# Altium schematic sheet IEPE.SchDoc
size A4; CompanyName: TH Nürnberg; Organization: UltraZohm; Address1: Kesslerplatz 12; Address2: 90489 Nürnberg; Address3: GERMANY; SheetNumber: 3; SheetTotal: 10
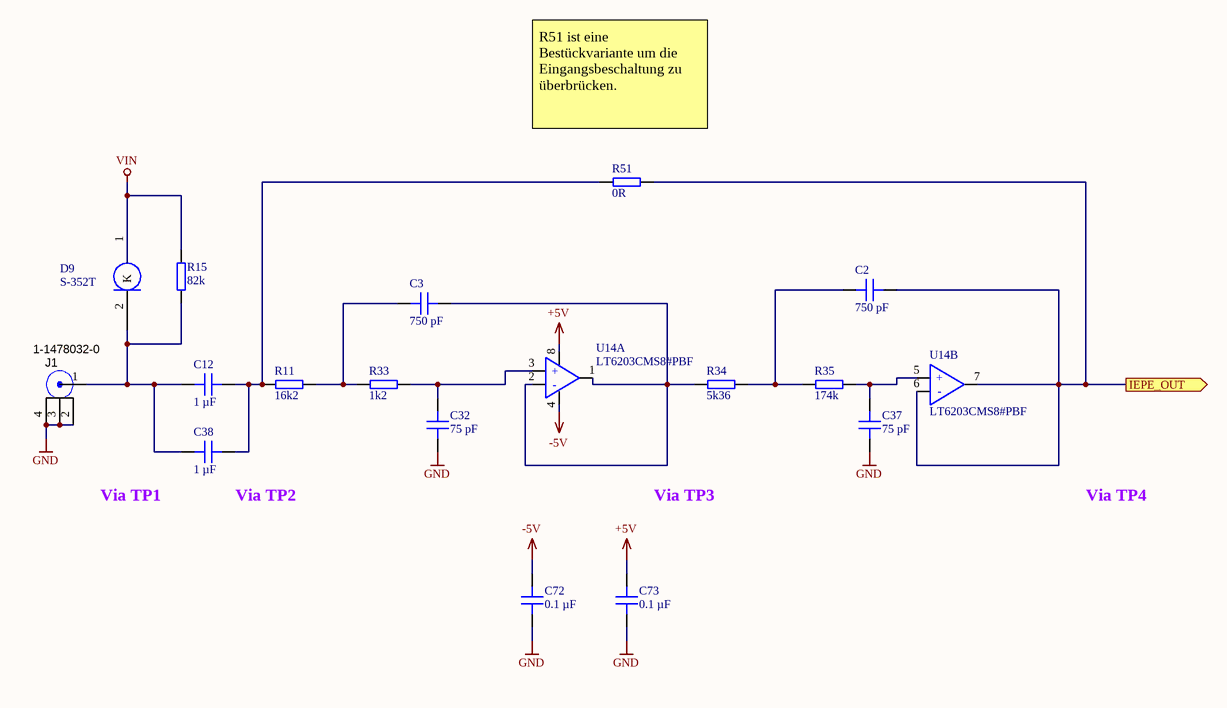
[diagram p0: IEPE.SchDoc]

## Parts
C2  750 pF  [C_0603]
C3  750 pF  [C_0603]
C12  1 µF  [C_0603]
C32  75 pF  [C_0603]
C37  75 pF  [C_0603]
C38  1 µF  [C_0603]
C72  0.1 µF  [C_0603]
C73  0.1 µF  [C_0603]
D9  S-352T  [CRD]
J1  1-1478032-0  [Right Angle BNC]
R11  16k2  [RES 0603_1608]
R15  82k  [RES 0603_1608]
R33  1k2  [RES 0603_1608]
R34  5k36  [RES 0603_1608]
R35  174k  [RES 0603_1608]
R51  0R  [RES 0603_1608]
U14  LT6203CMS8#PBF  [MSOP8_3x3-8N]  (parts A,B of 2)

## Ports
IEPE_OUT (out)

## Nets
+5V: C73.2 U14.8
-5V: C72.2 U14.4
GND: C32.1 C37.1 C72.1 C73.1 J1.2 J1.3 J1.4
VIN: D9.1(A) R15.2
IEPE_OUT: C2.2 R51.2 U14.6(-) U14.7 ; port IEPE_OUT
NetC2_1: C2.1 R34.2 R35.1
NetC3_1: C3.1 R11.2 R33.1
NetC3_2: C3.2 R34.1 U14.1 U14.2(-)
NetC12_1: C12.1 C38.1 D9.2(K) J1.1 R15.1
NetC12_2: C12.2 C38.2 R11.1 R51.1
NetC32_2: C32.2 R33.2 U14.3(+)
NetC37_2: C37.2 R35.2 U14.5(+)

## Notes on the sheet
- R51 ist eine Bestückvariante um die Eingangsbeschaltung zu überbrücken.
- (near C38) Via TP1
- (near C38) Via TP2
- Via TP3
- Via TP4
- Title
- Revision:
- Design Engineer:
- Date:
- Project:
- Sheet
- of

## Library data of the parts
C2 C3 = C0603C751J5GACAUTO: Capacitor 0603, 50 VDC, 750 pF, C0G; Manufacturer: KEMET; Tolerance: 5 %; Voltage Rating: 50 VDC; Created from: MGremer; Manufacturer Part Number: C0603C751J5GACAUTO; PartID: 82; Created On: 20.12.2020 13:54:13; ComponentLink1Description: Datasheet; ComponentLink1URL: https://www.mouser.de/datasheet/2/212/KEM_C1022_C0G_AUTO_SMD-1093282.pdf; Component Type: Capacitor 0603; Device Package: 0603; Last Updated: 20.01.2021 13:57:36; Mounting Type: SMD; Operating Temperature: -55 - 125°C; Series: C0G; Supplier 1: Mouser; Supplier Part Number 1: 80-C0603C751J5GAUTO; Type: Capacitor; Value: 750 pF; Live Cycle Status: 1; Stock number: not stored
C12 C38 = UMK107AB7105KA-T: Capacitor 0603, 50 VDC, 1 µF, X7R; Manufacturer: Taiyo Yuden; Tolerance: 10 %; Voltage Rating: 50 VDC; Created from: MGremer; Manufacturer Part Number: UMK107AB7105KA-T; PartID: 5; Created On: 20.12.2020 13:54:13; ComponentLink1Description: Datasheet; ComponentLink1URL: https://www.mouser.de/datasheet/2/396/mlcc02_e-1307760.pdf; Component Type: Capacitor 0603; Device Package: 0603; Last Updated: 20.12.2020 16:42:28; Mounting Type: SMD; Operating Temperature: -55 - 125°C; Series: M; Supplier 1: Mouser; Supplier Part Number 1: 963-UMK107AB7105KA-T; Type: Capacitor; Value: 1 µF; Live Cycle Status: 1; Stock number: Labor SMD Container
C32 C37 = C0603C750J5RACAUTO: Capacitor 0603, 50 VDC, 75 pF, X7R; Manufacturer: KEMET; Tolerance: 5 %; Voltage Rating: 50 VDC; Created from: MGremer; Manufacturer Part Number: C0603C750J5RACAUTO; PartID: 83; Created On: 20.12.2020 13:54:13; ComponentLink1Description: Datasheet; ComponentLink1URL: https://www.mouser.de/datasheet/2/212/KEM_C1023_X7R_AUTO_SMD-1093309.pdf; Component Type: Capacitor 0603; Device Package: 0603; Last Updated: 20.01.2021 13:57:36; Mounting Type: SMD; Operating Temperature: -55 - 125°C; Series: C0G; Supplier 1: Mouser; Supplier Part Number 1: 80-C0603C750J5RAUTO; Type: Capacitor; Value: 75 pF; Live Cycle Status: 1; Stock number: not stored
C72 C73 = C0603X104K5RAC7411: Capacitor 0603, 50 VDC, 0.1 µF, X7R; Manufacturer: KEMET; Tolerance: 10 %; Voltage Rating: 50 VDC; Created from: MGremer; Manufacturer Part Number: C0603X104K5RAC7411; PartID: 3; Created On: 20.12.2020 13:54:13; ComponentLink1Description: Datasheet; ComponentLink1URL: https://www.mouser.de/datasheet/2/212/1/KEM_C1013_X7R_FT_CAP_SMD-1103280.pdf; Component Type: Capacitor 0603; Device Package: 0603; Last Updated: 04.03.2021 09:24:28; Mounting Type: SMD; Operating Temperature: -55 - 125°C; Series: SMD Comm X7R Flex; Supplier 1: Mouser; Supplier Part Number 1: 80-C0603X104K5R7411; Supplier 2: LCSC; Supplier Part Number 2: C14663; Type: Capacitor; Value: 0.1 µF; Live Cycle Status: 1; LCSC Part Number: C14663; Stock number: Labor SMD Container
D9 = S-352T: Current Regulator Diodes 100V 3.5mA; Manufacturer: Semitec; Type: CRD Diode; Created from: PTurowski; Manufacturer Part Number: S-352T; PartID: 1; Created On: 25.05.2021 10:37:04; ComponentLink1Description: Datasheet; ComponentLink1URL: https://www.mouser.de/datasheet/2/362/P22-23-CRD-1729293.pdf; Component Type: CRD Diode; Last Updated: 25.05.2021 10:37:04; Mounting Type: SMD/SMT; Operating Temperature: -40 to 150 °C; Supplier 1: Mouser; Supplier Part Number 1: 954-S-352T; Live Cycle Status: 1; Stock number: 0
J1 = 1-1478032-0: BNC Connector; Manufacturer: TE; PartNumber: Used in BOM report; SymbolVersion: use current date i.e. 2008-05-20; SymbolCreator: Use LDAP id; CompType: Used in some BOM reports.  Useful for finding later.; U/M: EA, IN, or GM; Created from: FSchoenig, MGremer; MountType: SMT, TH, or N/A; RoHS: Used in BOM report.  Use Y or N.; PackageReference: eg:  0603, used in PnP report; ComponentLink1Description: Datasheet; ComponentLink1URL: https://www.te.com/commerce/DocumentDelivery/DDEController?Action=showdoc&DocId=Data+Sheet%7F6-1773448-5_ZDC_RF_COAX_50-75_OHM%7F1007%7Fpdf%7FEnglish%7FENG_DS_6-1773448-5_ZDC_RF_COAX_50-75_OHM_1007.pdf&src-supplier=Avnet; Alternate PartNumber: -; Alternate Manufacturer: -; Supplier 1: Digi-Key; Supplier Part Number 1: A97560-ND; Manufacturer Part Number: 1-1478032-0; PartID: 3; Created On: 12.05.2021 17:41:04; Component Type: BNC; Device Package: BNC; Last Updated: 24.08.2021 10:46:04; Mounting Type: THT; Type: BNC; Live Cycle Status: 1; Stock number: not stored
R11 = AC0603FR-0716K2L: SMD resistor 1%; Manufacturer: YAGEO; Created from: MGremer; Manufacturer Part Number: AC0603FR-0716K2L; PartID: 194; Created On: 14.12.2020 16:17:14; ComponentLink1Description: Datasheet; ComponentLink1URL: https://www.mouser.de/datasheet/2/447/PYu_AC_51_RoHS_L_7-1714230.pdf; Component Type: SMD resistor; Device Package: 0603; Last Updated: 02.07.2021 11:49:34; Mounting Type: SMD; Supplier 1: Mouser; Supplier Part Number 1: 603-AC0603FR-0716K2L; Type: Resistor; Tolerance: 1%; Value: 16k2; Live Cycle Status: 1; Stock number: not stored
R15 = RK73B1JTTDD823J: SMD resistor E24 series; Manufacturer: KOA Speer; Tolerance: 5%; Created from: MGremer; Manufacturer Part Number: RK73B1JTTDD823J; PartID: 120; Created On: 14.12.2020 16:17:14; ComponentLink1Description: Datasheet; ComponentLink1URL: https://www.mouser.de/datasheet/2/219/RK73B-1825463.pdf; Component Type: SMD resistor; Device Package: 0603; Last Updated: 02.03.2021 14:07:32; Mounting Type: SMD; Supplier 1: Mouser; Supplier Part Number 1: 660-RK73B1JTTDD823J; Type: Resistor; Value: 82k; Live Cycle Status: 1; Stock number: Labor SMD Container
R33 = RK73B1JTTD122J: SMD resistor E24 series; Manufacturer: KOA Speer; Tolerance: 5%; Created from: MGremer; Manufacturer Part Number: RK73B1JTTD122J; PartID: 76; Created On: 14.12.2020 16:17:14; ComponentLink1Description: Datasheet; ComponentLink1URL: https://www.mouser.de/datasheet/2/219/RK73B-1825463.pdf; Component Type: SMD resistor; Device Package: 0603; Last Updated: 02.03.2021 14:07:32; Mounting Type: SMD; Supplier 1: Mouser; Supplier Part Number 1: 660-RK73B1JTTD122J; Type: Resistor; Value: 1k2; Live Cycle Status: 1; Stock number: Labor SMD Container
R34 = AC0603FR-075K36L: SMD resistor 1%; Manufacturer: YAGEO; Created from: MGremer; Manufacturer Part Number: AC0603FR-075K36L; PartID: 195; Created On: 14.12.2020 16:17:14; ComponentLink1Description: Datasheet; ComponentLink1URL: https://www.mouser.de/datasheet/2/447/PYu_AC_51_RoHS_L_7-1714230.pdf; Component Type: SMD resistor; Device Package: 0603; Last Updated: 02.07.2021 11:49:34; Mounting Type: SMD; Supplier 1: Mouser; Supplier Part Number 1: 603-AC0603FR-075K36L; Type: Resistor; Tolerance: 1%; Value: 5k36; Live Cycle Status: 1; Stock number: not stored
R35 = RC0603FR-07174KL: SMD resistor 1%; Manufacturer: YAGEO; Created from: MGremer; Manufacturer Part Number: RC0603FR-07174KL; PartID: 196; Created On: 14.12.2020 16:17:14; ComponentLink1Description: Datasheet; ComponentLink1URL: https://www.mouser.de/datasheet/2/447/Yageo_03_18_2021_PYu_RC_Group_51_RoHS_L_11-2199992.pdf; Component Type: SMD resistor; Device Package: 0603; Last Updated: 02.07.2021 11:49:34; Mounting Type: SMD; Supplier 1: Mouser; Supplier Part Number 1: 603-RC0603FR-07174KL; Type: Resistor; Tolerance: 1%; Value: 174k; Live Cycle Status: 1; Stock number: not stored
R51 = RC0603JR-070RL: SMD resistor E24 series; Manufacturer: YAGEO; Tolerance: 5%; Created from: MGremer; Manufacturer Part Number: RC0603JR-070RL; PartID: 1; Created On: 14.12.2020 16:17:14; ComponentLink1Description: Datasheet; ComponentLink1URL: https://www.mouser.de/datasheet/2/447/PYu-RC_Group_51_RoHS_L_10-1664068.pdf; Component Type: SMD resistor; Device Package: 0603; Last Updated: 04.03.2021 09:09:42; Mounting Type: SMD; Supplier 1: Mouser; Supplier Part Number 1: 603-RC0603JR-070RL; Supplier 2: LCSC; Supplier Part Number 2: C21189; Type: Resistor; Value: 0R; Live Cycle Status: 1; Stock number: Labor SMD Container; LCSC Part Number: C21189
U14 = LT6203CMS8#PBF: Operational Amplifier, Rail-to-Rail, ultralow noise; Manufacturer: Analog Devices; Channels: 2; GBP: 100 MHz; CMRR: 85 dB; Created from: MGremer; Manufacturer Part Number: LT6203CMS8#PBF; PartID: 1; Created On: 15.01.2021 11:55:32; ComponentLink1Description: Datasheet; ComponentLink1URL: https://www.mouser.de/datasheet/2/609/620234fd-1279470.pdf; Component Type: Operational Amplifier; Device Package: MSOP-8; Last Updated: 15.01.2021 12:06:43; Mounting Type: SMD; Operating Temperature: 0 - 70 °C; Supplier 1: Mouser; Supplier Part Number 1: 584-LT6203CMS8#PBF; Type: OPV; Value: Rail-to-Rail; Live Cycle Status: 1; Stock number: not stored